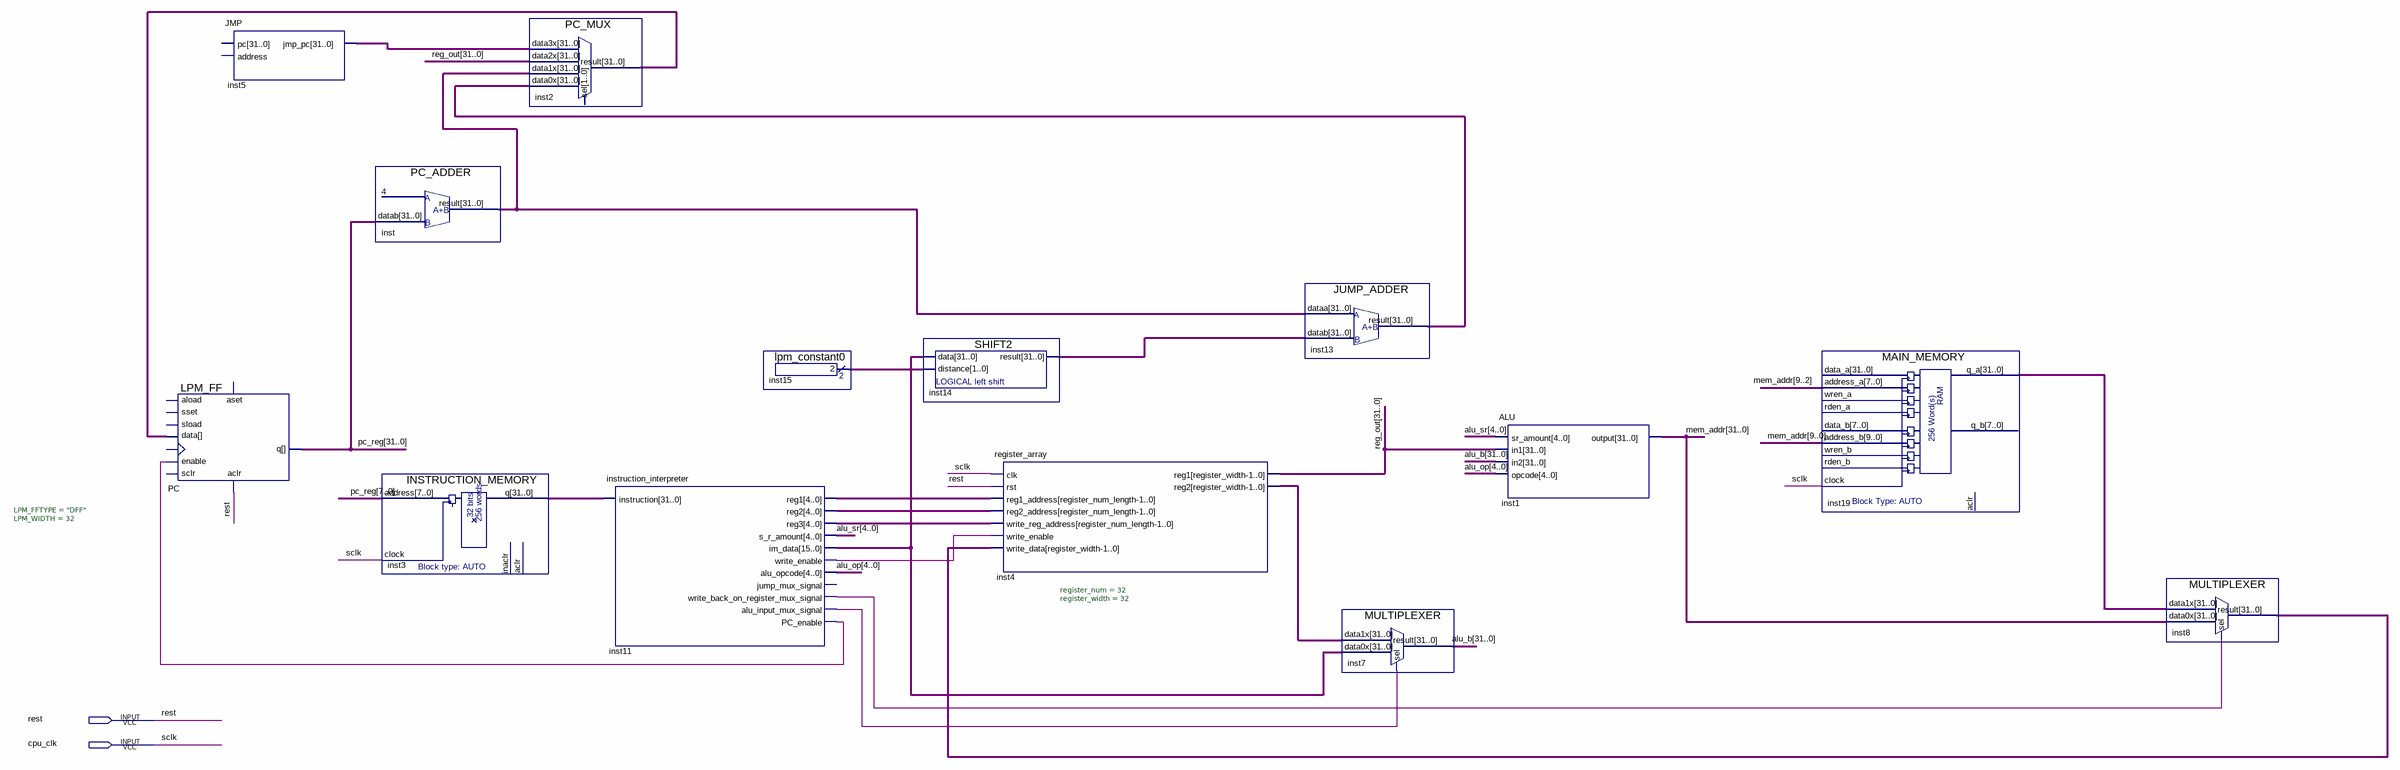
[diagram p0: schematic sheet]
// Quartus schematic CPUProject.bdf as structural Verilog: 14 symbols, 2 pins
module CPUProject (
  input  rest,
  input  cpu_clk
);

  wire inst11_alu_input_mux_signal, inst11_pc_enable, inst11_write_back_on_register_mux_signal,
       inst11_write_enable;
  wire [1:0] inst15_result;
  wire [4:0] alu_op, alu_sr, inst11_reg1, inst11_reg2, inst11_reg3;
  wire [31:0] alu_b, inst2_result, inst3_q, inst4_reg2, inst5_jmp_pc, inst8_result, inst11_im_data,
       inst13_result, inst14_result, inst19_q_a, inst_result, mem_addr, pc_reg, reg_out;

  LPM_FF #(.LPM_FFTYPE("DFF"), .LPM_WIDTH(32)) PC (
    .enable(inst11_pc_enable), .aclr(rest), .data(inst2_result), .q(pc_reg));  // open: clock, aload, sset, sload, aset, sclr
  JMP inst5 (.jmp_pc(inst5_jmp_pc));  // open: pc, address
  PC_ADDER inst (.datab(pc_reg), .result(inst_result));
  INSTRUCTION_MEMORY inst3 (.address(pc_reg[7:0]), .clock(cpu_clk), .q(inst3_q));  // open: aclr, inaclr
  PC_MUX inst2 (
    .data3x(inst5_jmp_pc), .data2x(reg_out), .data1x(inst_result), .data0x(inst13_result),
    .result(inst2_result));  // open: sel
  instruction_interpreter inst11 (
    .instruction(inst3_q), .reg1(inst11_reg1), .reg2(inst11_reg2), .reg3(inst11_reg3), .s_r_amount(alu_sr),
    .im_data(inst11_im_data), .write_enable(inst11_write_enable), .alu_opcode(alu_op),
    .write_back_on_register_mux_signal(inst11_write_back_on_register_mux_signal),
    .alu_input_mux_signal(inst11_alu_input_mux_signal), .PC_enable(inst11_pc_enable));  // open: jump_mux_signal
  lpm_constant0 inst15 (.result(inst15_result));
  SHIFT2 inst14 (.data(inst11_im_data), .distance(inst15_result), .result(inst14_result));
  register_array #(.register_num(32), .register_width(32)) inst4 (
    .clk(cpu_clk), .rst(rest), .reg1_address(inst11_reg1), .reg2_address(inst11_reg2),
    .write_reg_address(inst11_reg3), .write_enable(inst11_write_enable), .write_data(inst8_result),
    .reg1(reg_out), .reg2(inst4_reg2));
  JUMP_ADDER inst13 (.dataa(inst_result), .datab(inst14_result), .result(inst13_result));
  MULTIPLEXER inst7 (.data1x(inst4_reg2), .data0x(inst11_im_data), .sel(inst11_alu_input_mux_signal), .result(alu_b));
  ALU inst1 (.sr_amount(alu_sr), .in1(reg_out), .in2(alu_b), .opcode(alu_op), .\output (mem_addr));
  MAIN_MEMORY inst19 (
    .address_a(mem_addr[9:2]), .address_b(mem_addr[9:0]), .clock(cpu_clk), .q_a(inst19_q_a));  // open: data_a, wren_a, rden_a, data_b, wren_b, rden_b, aclr, q_b
  MULTIPLEXER inst8 (
    .data1x(inst19_q_a), .data0x(mem_addr), .sel(inst11_write_back_on_register_mux_signal),
    .result(inst8_result));

  // Other names for the same wires on the sheet: sclk = cpu_clk
endmodule
